# Altium schematic sheet Sam4S main control board.SchDoc
size A
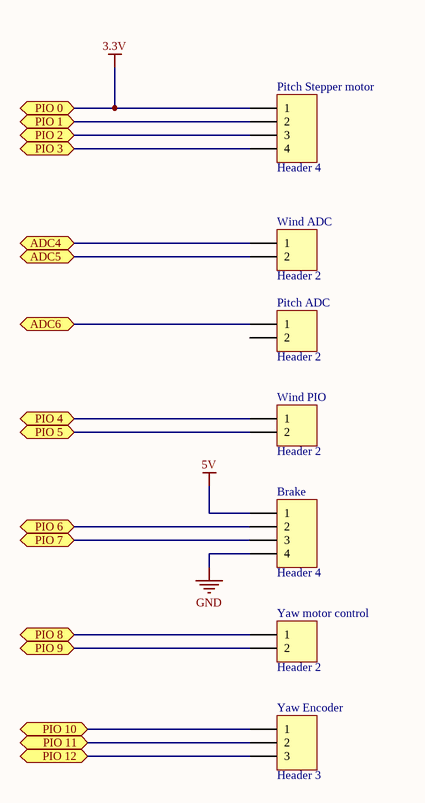
[diagram p0: Sam4S main control board.SchDoc]

## Parts
Brake  Header 4  [HDR1X4]
Pitch_ADC  Header 2  [HDR1X2]
Pitch_Stepper_motor  Header 4  [HDR1X4]
Wind_ADC  Header 2  [HDR1X2]
Wind_PIO  Header 2  [HDR1X2]
Yaw_Encoder  Header 3  [HDR1X3]
Yaw_motor_control  Header 2  [HDR1X2]

## Ports
ADC4, ADC5, ADC6, PIO 0, PIO 1, PIO 2, PIO 3, PIO 4, PIO 5, PIO 6, PIO 7, PIO 8, PIO 9, PIO 10, PIO 11, PIO 12

## Nets
3.3V: Pitch_Stepper_motor.1 ; port PIO 0
5V: Brake.1
GND: Brake.4
ADC4: Wind_ADC.1 ; port ADC4
ADC5: Wind_ADC.2 ; port ADC5
ADC6: Pitch_ADC.1 ; port ADC6
PIO 1: Pitch_Stepper_motor.2 ; port PIO 1
PIO 2: Pitch_Stepper_motor.3 ; port PIO 2
PIO 3: Pitch_Stepper_motor.4 ; port PIO 3
PIO 4: Wind_PIO.1 ; port PIO 4
PIO 5: Wind_PIO.2 ; port PIO 5
PIO 6: Brake.2 ; port PIO 6
PIO 7: Brake.3 ; port PIO 7
PIO 8: Yaw_motor_control.1 ; port PIO 8
PIO 9: Yaw_motor_control.2 ; port PIO 9
PIO 10: Yaw_Encoder.1 ; port PIO 10
PIO 11: Yaw_Encoder.2 ; port PIO 11
PIO 12: Yaw_Encoder.3 ; port PIO 12

Not connected (* = marked no-connect by the designer): Pitch_ADC 2

## Library data of the parts
Brake Pitch_Stepper_motor = Header 4: Header, 4-Pin; LatestRevisionDate: 17-Jul-2002; LatestRevisionNote: Re-released for DXP Platform.; Publisher: Altium Limited
Pitch_ADC Wind_ADC Wind_PIO Yaw_motor_control = Header 2: Header, 2-Pin; LatestRevisionDate: 17-Jul-2002; LatestRevisionNote: Re-released for DXP Platform.; Publisher: Altium Limited
Yaw_Encoder = Header 3: Header, 3-Pin; LatestRevisionDate: 17-Jul-2002; LatestRevisionNote: Re-released for DXP Platform.; Publisher: Altium Limited